# EAGLE design StaticPlatformMain_v1 (EAGLE 9.6.2)
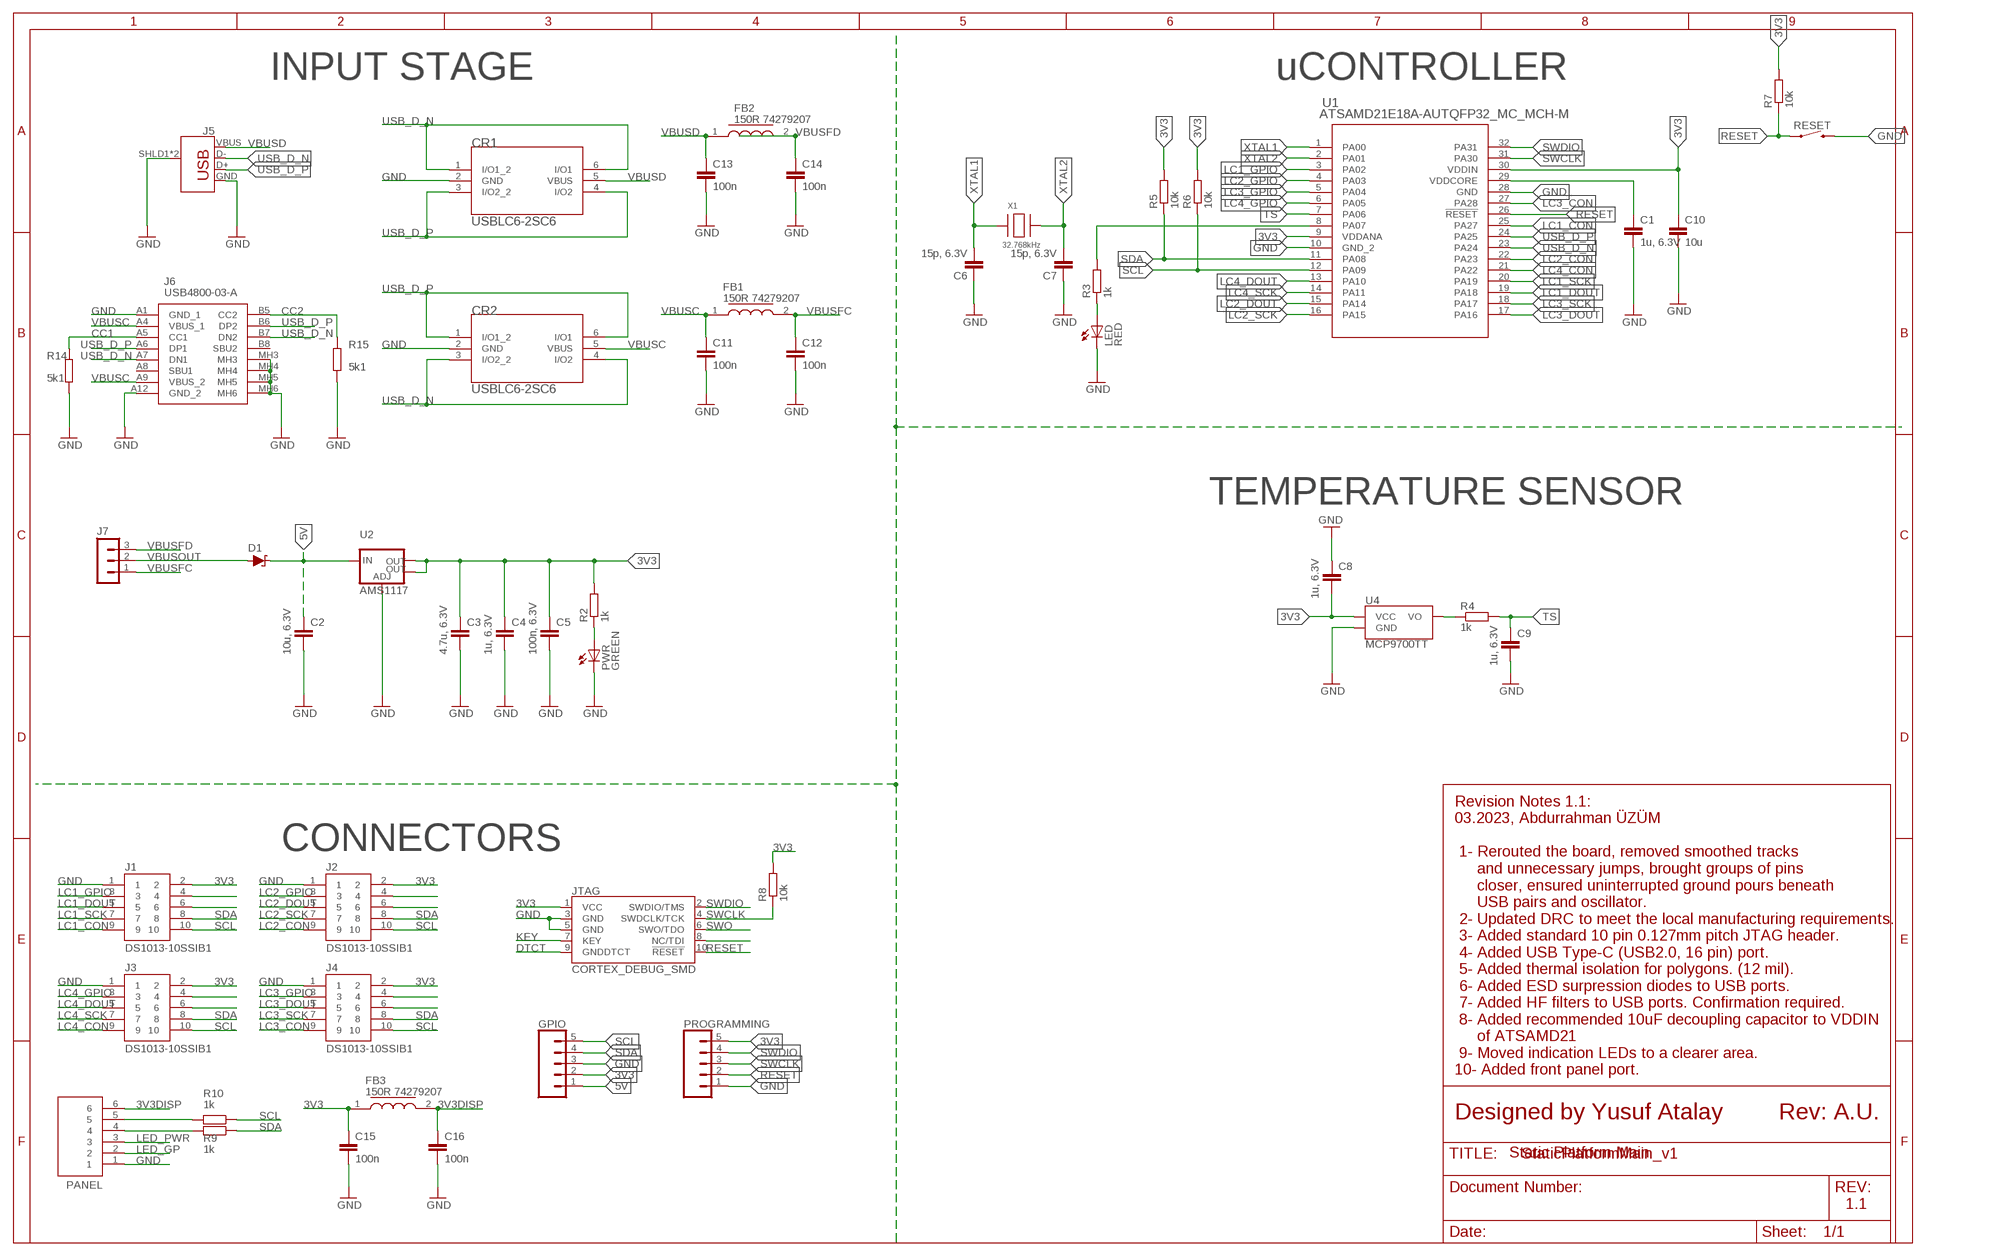
[diagram p0: schematic, sheet 1]

## Parts
C1  1u, 6.3V  C-EUC0805  [C0805]
C2  10u, 6.3V  C-EUC0805  [C0805]
C3  4.7u, 6.3V  C-EUC0805  [C0805]
C4  1u, 6.3V  C-EUC0805  [C0805]
C5  100n, 6.3V  C-EUC0805  [C0805]
C6  15p, 6.3V  C-EUC0805  [C0805]
C7  15p, 6.3V  C-EUC0805  [C0805]
C8  1u, 6.3V  C-EUC0805  [C0805]
C9  1u, 6.3V  C-EUC0805  [C0805]
C10  10u  C-EUC0805  [C0805]
C11  100n  C-EUC0805  [C0805]
C12  100n  C-EUC0805  [C0805]
C13  100n  C-EUC0805  [C0805]
C14  100n  C-EUC0805  [C0805]
C15  100n  C-EUC0805  [C0805]
C16  100n  C-EUC0805  [C0805]
CR1  USBLC6-2SC6  [SOT23-6L_STM]
CR2  USBLC6-2SC6  [SOT23-6L_STM]
D1  3A/10V/280mV  DIODE-SCHOTTKY-BAT60A  [SOD-323]
FB1  150R 74279207  74279207  [CAPC2012X90N]
FB2  150R 74279207  74279207  [CAPC2012X90N]
FB3  150R 74279207  74279207  [CAPC2012X90N]
GPIO  CONN_05NO_SILK  [1X05_NO_SILK]
J1  DS1013-10SSIB1  [CONNFLY_DS1013-10SSIB1]
J2  DS1013-10SSIB1  [CONNFLY_DS1013-10SSIB1]
J3  DS1013-10SSIB1  [CONNFLY_DS1013-10SSIB1]
J4  DS1013-10SSIB1  [CONNFLY_DS1013-10SSIB1]
J5  USB_B_PTH  [USB-B-PTH]
J6  USB4800-03-A  [USB480003A]
J7  MA03-1  [MA03-1]
JTAG  CORTEX_DEBUG_SMD  [SAMTECH_FTSH-105-01]
LED  RED  LEDCHIPLED_0805  [CHIPLED_0805]
PANEL  S3B-XH-A(LF)(SN)  [JST_S3B-XH-A(LF)(SN)]
PROGRAMMING  CONN_05NO_SILK  [1X05_NO_SILK]
PWR  GREEN  LEDCHIPLED_0805  [CHIPLED_0805]
R2  1k  R-EU_R0805  [R0805]
R3  1k  R-EU_R0805  [R0805]
R4  1k  R-EU_R0805  [R0805]
R5  10k  R-EU_R0805  [R0805]
R6  10k  R-EU_R0805  [R0805]
R7  10k  R-EU_R0805  [R0805]
R8  10k  R-EU_R0805  [R0805]
R9  1k  R-EU_R0805  [R0805]
R10  1k  R-EU_R0805  [R0805]
R14  5k1  R-EU_R0805  [R0805]
R15  5k1  R-EU_R0805  [R0805]
RESET  MOMENTARY-SWITCH-SPST-SMD-6.0X3.5MM  [TACTILE_SWITCH_SMD_6.0X3.5MM]
U1  ATSAMD21E18A-AUTQFP32_MC_MCH-M  [TQFP32_MC_MCH-M]
U2  AMS1117  V_REG_LM1117SOT223  [SOT223]
U4  MCP9700TT  [SOT23-3]
X1  32.768kHz  XTAL-3.2X1.5  [XTAL3215]

## Nets
3V1: R3.2 U1.8(PA07)
3V3: C3.1 C4.1 C5.1 C8.2 C10.1 C15.1 FB3.1 GPIO.2 J1.2 J2.2 J3.2 J4.2 JTAG.1(VCC) PROGRAMMING.5 R2.2 R5.2 R6.2 R7.2 R8.2 U1.9(VDDANA) U1.30(VDDIN) U2.2(OUT) U2.4(OUT) U4.1(VCC)
3V3DISP: C16.1 FB3.2 PANEL.6
5V: C2.1 D1.C GPIO.1 U2.3(IN)
CC1: J6.A5(CC1) R14.2
CC2: J6.B5(CC2) R15.2
DTCT: JTAG.9(GNDDTCT)
GND: C1.2 C2.2 C3.2 C4.2 C5.2 C6.1 C7.1 C8.1 C9.2 C10.2 C11.2 C12.2 C13.2 C14.2 C15.2 C16.2 CR1.2(GND) CR2.2(GND) GPIO.3 J1.1 J2.1 J3.1 J4.1 J5.GND J5.SHLD1(SHIELD) J5.SHLD2(SHIELD) J6.A1(GND_1) J6.A12(GND_2) J6.MH3 J6.MH4 J6.MH5 J6.MH6 JTAG.3(GND) JTAG.5(GND) LED.C PANEL.1 PROGRAMMING.1 PWR.C R14.1 R15.1 RESET.2 U1.10(GND_2) U1.28(GND) U2.1(ADJ) U4.3(GND)
KEY: JTAG.7(KEY)
LC1_CON: J1.9 U1.25(PA27)
LC1_DOUT: J1.5 U1.19(PA18)
LC1_GPIO: J1.3 U1.3(PA02)
LC1_SCK: J1.7 U1.20(PA19)
LC2_CON: J2.9 U1.22(PA23)
LC2_DOUT: J2.5 U1.15(PA14)
LC2_GPIO: J2.3 U1.4(PA03)
LC2_SCK: J2.7 U1.16(PA15)
LC3_CON: J4.9 U1.27(PA28)
LC3_DOUT: J4.5 U1.17(PA16)
LC3_GPIO: J4.3 U1.5(PA04)
LC3_SCK: J4.7 U1.18(PA17)
LC4_CON: J3.9 U1.21(PA22)
LC4_DOUT: J3.5 U1.13(PA10)
LC4_GPIO: J3.3 U1.6(PA05)
LC4_SCK: J3.7 U1.14(PA11)
LED_GP: LED.A PANEL.2 R3.1
LED_PWR: PANEL.3 PWR.A R2.1
N$1: PANEL.5 R10.2
N$2: PANEL.4 R9.2
N$6: C1.1 U1.29(VDDCORE)
N$8: R4.1 U4.2(VO)
N$13: J1.4
N$16: J1.6
N$24: JTAG.8(NC/TDI)
N$28: J2.4
N$29: J2.6
N$38: J4.4
N$39: J4.6
N$48: J3.4
N$49: J3.6
RESET: JTAG.10(!RESET) PROGRAMMING.2 R7.1 RESET.1 U1.26(!RESET)
SCL: GPIO.5 J1.10 J2.10 J3.10 J4.10 R6.1 R10.1 U1.12(PA09)
SDA: GPIO.4 J1.8 J2.8 J3.8 J4.8 R5.1 R9.1 U1.11(PA08)
SWCLK: JTAG.4(SWDCLK/TCK) PROGRAMMING.3 R8.1 U1.31(PA30)
SWDIO: JTAG.2(SWDIO/TMS) PROGRAMMING.4 U1.32(PA31)
SWO: JTAG.6(SWO/TDO)
TS: C9.1 R4.2 U1.7(PA06)
USB_D_N [usbpair]: CR1.1(I/O1_2) CR1.6(I/O1) CR2.3(I/O2_2) CR2.4(I/O2) J5.D- J6.A7(DN1) J6.B7(DN2) U1.23(PA24)
USB_D_P [usbpair]: CR1.3(I/O2_2) CR1.4(I/O2) CR2.1(I/O1_2) CR2.6(I/O1) J5.D+ J6.A6(DP1) J6.B6(DP2) U1.24(PA25)
VBUSC: C11.1 CR2.5(VBUS) FB1.1 J6.A4(VBUS_1) J6.A9(VBUS_2)
VBUSD: C13.1 CR1.5(VBUS) FB2.1 J5.VBUS
VBUSFC: C12.1 FB1.2 J7.1
VBUSFD: C14.1 FB2.2 J7.3
VBUSOUT: D1.A J7.2
XTAL1: C6.2 U1.1(PA00) X1.P$1
XTAL2: C7.2 U1.2(PA01) X1.P$2
Unconnected: J6.A8(SBU1) J6.B8(SBU2)

## Notes on the sheet
- INPUT STAGE | uCONTROLLER
- TEMPERATURE SENSOR
- CONNECTORS
- Revision Notes 1.1:
  03.2023, Abdurrahman ÜZÜM
  
   1- Rerouted the board, removed smoothed tracks
       and unnecessary jumps, brought groups of pins
       closer, ensured uninterrupted ground pours beneath
       USB pairs and oscillator.
   2- Updated DRC to meet the local manufacturing requirements.
   3- Added standard 10 pin 0.127mm pitch JTAG header.
   4- Added USB Type-C (USB2.0, 16 pin) port.
   5- Added thermal isolation for polygons. (12 mil).
   6- Added ESD surpression diodes to USB ports.
   7- Added HF filters to USB ports. Confirmation required.
   8- Added recommended 10uF decoupling capacitor to VDDIN
       of ATSAMD21
   9- Moved indication LEDs to a clearer area.
  10- Added front panel port.
- Designed by Yusuf Atalay | Rev: A.U.
- Static Platform Main
- 1.1

## Library data of the parts
C1-C16 = rcl:C-EU: CAPACITOR, European symbol; SPICEPREFIX: C
CR1 CR2 = usblc6:USBLC6-2SC6; COPYRIGHT: Copyright (C) 2023 Ultra Librarian. All rights reserved.; MANUFACTURER_PART_NUMBER: USBLC6-2SC6; MFR_NAME: STMicroelectronics
D1 = SparkFun-DiscreteSemi:DIODE-SCHOTTKY: Schottky diode A Schottky diode is a semiconductor diode which has a low forward voltage drop and a very fast switching action.; PROD_ID: DIO-14072
FB1-FB3 = FB_74279207:74279207: SMD EMI Suppression Ferrite Beads WE-CBF Source: Datasheet; DESCRIPTION: SMD EMI Suppression Ferrite Beads WE-CBF; HEIGHT: 0.9mm; MANUFACTURER_NAME: Wurth Elektronik; MANUFACTURER_PART_NUMBER: 74279207; MOUSER_PART_NUMBER: 710-74279207; MOUSER_PRICE-STOCK: https://www.mouser.co.uk/ProductDetail/Wurth-Elektronik/74279207?qs=Wn16VcyqZWrAx3dDPZmCbQ%3D%3D
GPIO PROGRAMMING = SparkFun-Connectors:CONN_05: Multi connection point. Often used as Generic Header-pin footprint for 0.1 inch spaced/style header connections On any of the 0.1 inch spaced packages, you can populate with these: Break Away Headers - Straight <https://www.sparkfun.com/products/116> (PRT-00116) Break Away Male Headers - Right Angle <https://www.sparkfun.com/products/553> (PRT-00553) Female Headers <https://www.sparkfun.com/products/115> (PRT-00115) Break Away Headers - Machine Pin <https://www.sparkfun.com/products/117> (PRT-00117) Break Away Female Headers - Swiss Machine Pin <https://www.sparkfun.com/products/743> (PRT-00743) For SCREWTERMINALS and SPRING TERMINALS visit here: Screw Terimnals on SparkFun.com <https://www.sparkfun.com/search/results?term=Screw+Terminals> (5mm/3.5mm/2.54mm spacing) This device is also useful as a general connection point to wire up your design to another part of your project. Our various solder wires solder well into these plated through hole pads. Hook-Up Wire - Assortment (Stranded, 22 AWG) <https://www.sparkfun.com/products/11375> (PRT-11375) Hook-Up Wire - Assortment (Solid Core, 22 AWG) <https://www.sparkfun.com/products/11367> (PRT-11367) View the entire wire category on our website here <https://www.sparkfun.com/categories/141> Special notes: Molex polarized connector foot print use with SKU : PRT-08231 with associated crimp pins and housings. 1MM SMD Version SKU: PRT-10208
J1-J4 = IDC_CON_DS1013-10SSIB1:DS1013-10SSIB1: Socket; IDC; male; PIN: 10; straight; THT; gold-plated; 2.54mm Check availability <https://pricing.snapeda.com/parts/DS1013-10SSIB1/Connfly/view-part?ref=eda>; AVAILABILITY: Not in stock; DESCRIPTION: Socket; IDC; male; PIN: 10; straight; THT; gold plated; 2.54mm; MF: Connfly; MP: DS1013-10SSIB1; PACKAGE: None; PRICE: None
J5 = SparkFun-Connectors:USB_B: USB Type B Connector SparkFun Products: SparkFun Stepoko <https://www.sparkfun.com/products/13899> PTH; PROD_ID: CONN-08278; SF_ID: PRT-00139
J6 = USB4800-03-A:USB4800-03-A: USB Connectors USB2.0 Type C Rcpt, SMT, Hrz, 3.5mm elevated, 16 Pin Source: Datasheet <https://gct.co/connector/usb4800>; DESCRIPTION: USB Connectors USB2.0 Type C Rcpt, SMT, Hrz, 3.5mm elevated, 16 Pin; HEIGHT: 5.58mm; MANUFACTURER_NAME: GCT (GLOBAL CONNECTOR TECHNOLOGY); MANUFACTURER_PART_NUMBER: USB4800-03-A; MOUSER_PART_NUMBER: 640-USB4800-03-A; MOUSER_PRICE-STOCK: https://www.mouser.co.uk/ProductDetail/GCT/USB4800-03-A?qs=vvQtp7zwQdMkfG8vViEZoQ%3D%3D
J7 = con-lstb_round_pads:MA03-1: PIN HEADER; OC_FARNELL: unknown; OC_NEWARK: unknown
JTAG = SparkFun-Connectors:CORTEX_DEBUG: Cortex Debug Connector - 10 pin Supports JTAG debug, Serial Wire debug, and Serial Wire Viewer. PTH and SMD connector options available. General Connector Information <http://infocenter.arm.com/help/topic/com.arm.doc.faqs/attached/13634/cortex_debug_connectors.pdf> Products: PTH Connector <http://www.digikey.com/product-detail/en/cnc-tech/3220-10-0100-00/1175-1627-ND/3883661> -via Digi-Key SparkFun PSoc <https://www.sparkfun.com/products/13229> SparkFun T <https://www.sparkfun.com/products/13810>
LED PWR = adafruit:LED: LED OSRAM: - CHIPLED LG R971, LG N971, LY N971, LG Q971, LY Q971, LO R971, LY R971 LH N974, LH R974 LS Q976, LO Q976, LY Q976 LO Q996 - Hyper CHIPLED LW Q18S LB Q993, LB Q99A, LB R99A - SideLED LS A670, LO A670, LY A670, LG A670, LP A670 LB A673, LV A673, LT A673, LW A673 LH A674 LY A675 LS A676, LA A676, LO A676, LY A676, LW A676 LS A679, LY A679, LG A679 - Hyper Micro SIDELED® LS Y876, LA Y876, LO Y876, LY Y876 LT Y87S - SmartLED LW L88C, LW L88S LB L89C, LB L89S, LG L890 LS L89K, LO L89K, LY L89K LS L896, LA L896, LO L896, LY L896 - TOPLED LS T670, LO T670, LY T670, LG T670, LP T670 LSG T670, LSP T670, LSY T670, LOP T670, LYG T670 LG T671, LOG T671, LSG T671 LB T673, LV T673, LT T673, LW T673 LH T674 LS T676, LA T676, LO T676, LY T676, LB T676, LH T676, LSB T676, LW T676 LB T67C, LV T67C, LT T67C, LS T67K, LO T67K, LY T67K, LW E67C LS E67B, LA E67B, LO E67B, LY E67B, LB E67C, LV E67C, LT E67C LW T67C LS T679, LY T679, LG T679 LS T770, LO T770, LY T770, LG T770, LP T770 LB T773, LV T773, LT T773, LW T773 LH T774 LS E675, LA E675, LY E675, LS T675 LS T776, LA T776, LO T776, LY T776, LB T776 LHGB T686 LT T68C, LB T68C - Hyper Mini TOPLED® LB M676 - Mini TOPLED Santana® LG M470 LS M47K, LO M47K, LY M47K Source: http://www.osram.convergy.de/
PANEL = S6B-XH-A_LF__SN_:S3B-XH-A(LF)(SN): Connector Header Through Hole, Right Angle 3 position 0.098" (2.50mm) Check availability <https://pricing.snapeda.com/parts/S3B-XH-A%28LF%29%28SN%29/JST%20Sales/view-part?ref=eda>; AVAILABILITY: In Stock; DESCRIPTION: Connector Header Through Hole, Right Angle 3 position 0.098 (2.50mm); MF: JST Sales; MP: S3B-XH-A(LF)(SN); PACKAGE: Custom Package JST Sales; PRICE: None; PURCHASE-URL: https://pricing.snapeda.com/search/part/S3B-XH-A(LF)(SN)/?ref=eda
R2-R10 R14 R15 = rcl:R-EU_: RESISTOR, European symbol; SPICEPREFIX: R
RESET = SparkFun-Switches:MOMENTARY-SWITCH-SPST: Momentary Switch (Pushbutton) - SPST Normally-open (NO) SPST momentary switches (buttons, pushbuttons). Variants PTH-12MM - 12mm square, through-hole Momentary Pushbutton Switch - 12mm Square <https://www.sparkfun.com/products/9190> (COM-09190) PTH-6.0MM, PTH-6.0MM-KIT - 6.0mm square, through-hole Mini Pushbutton Switch <https://www.sparkfun.com/products/97> (COM-00097) KIT package intended for soldering kit's - only one side of pads' copper is exposed. PTH-RIGHT-ANGLE-KIT - Right-angle, through-hole Right Angle Tactile Button <https://www.sparkfun.com/products/10791> - Used on SparkFun BigTime Watch Kit <https://www.sparkfun.com/products/11734> SMD-12MM - 12mm square, surface-mount Tactile Button - SMD (12mm) <https://www.sparkfun.com/products/12993> (COM-12993) Used on SparkFun PicoBoard <https://www.sparkfun.com/products/11888> SMD-4.5MM - 4.5mm Square Trackball Switch Used on SparkFun Blackberry Trackballer Breakout <https://www.sparkfun.com/products/13169> SMD-4.6MMX2.8MM - 4.60mm x 2.80mm, surface mount Used on SparkFun Pro Micro - RP2040 <https://www.sparkfun.com/products/17717> SMD-5.2MM, SMD-5.2-REDUNDANT - 5.2mm square, surface-mount Mini Pushbutton Switch - SMD <https://www.sparkfun.com/products/8720> (COM-08720) Used on Arduino Pro Mini <https://www.sparkfun.com/products/11114> REDUNDANT package connects both switch circuits together SMD-6.0X3.5MM - 6.0 x 3.5mm, surface mount Momentary Reset Switch SMD <https://www.sparkfun.com/products/8229> (COM-08229) SMD-6.2MM-TALL - 6.2mm square, surface mount Tactile Button - SMD (6mm) <https://www.sparkfun.com/products/12992> Used on SparkFun Digital Sandbox <https://www.sparkfun.com/products/12651> SMD-RIGHT-ANGLE - Right-angle, surface mount Used on SparkFun Block for Intel® Edison - Arduino <https://www.sparkfun.com/products/13036>; PROD_ID: SWCH-14278; SF_SKU: COM-08229
U1 = SAMD21E18:ATSAMD21E18A-AU; COPYRIGHT: Copyright (C) 2022 Ultra Librarian. All rights reserved.; MANUFACTURER_PART_NUMBER: ATSAMD21E18A-AU; MFR_NAME: Microchip
U2 = SparkFun-IC-Power:V_REG_LM1117: Voltage Regulator LM1117 Standard adjustable voltage regulator but in SMD form. Spark Fun Electronics SKU : COM-00595; PROD_ID: VREG-08170
U4 = SparkFun-Sensors:MCP9700: Microchip MCP9700 Analog-Output Temperature Sensor The MCP9700 can accurately measure temperature from -40C to +150C. The output of the MCP9700 is calibrated to a slope of 10mV/°C and has a DC offset of 500mV. The offset allows reading negative temperatures without the need for a negative supply. Datasheet <http://ww1.microchip.com/downloads/en/DeviceDoc/20001942F.pdf> SparkFun Products LilyPad Temperature Sensor <https://www.sparkfun.com/products/8777> (DEV-08777) SparkFun Digital Sandbox <https://www.sparkfun.com/products/12651> (DEV-12651); PROD_ID: IC-08917
X1 = adafruit:XTAL: Low cost SMT crystals, no capacitors included http://www.ladyada.net/library/eagle

## Net classes
1 usbpair: width 0.25 mm, clearance 0.2 mm

## Board
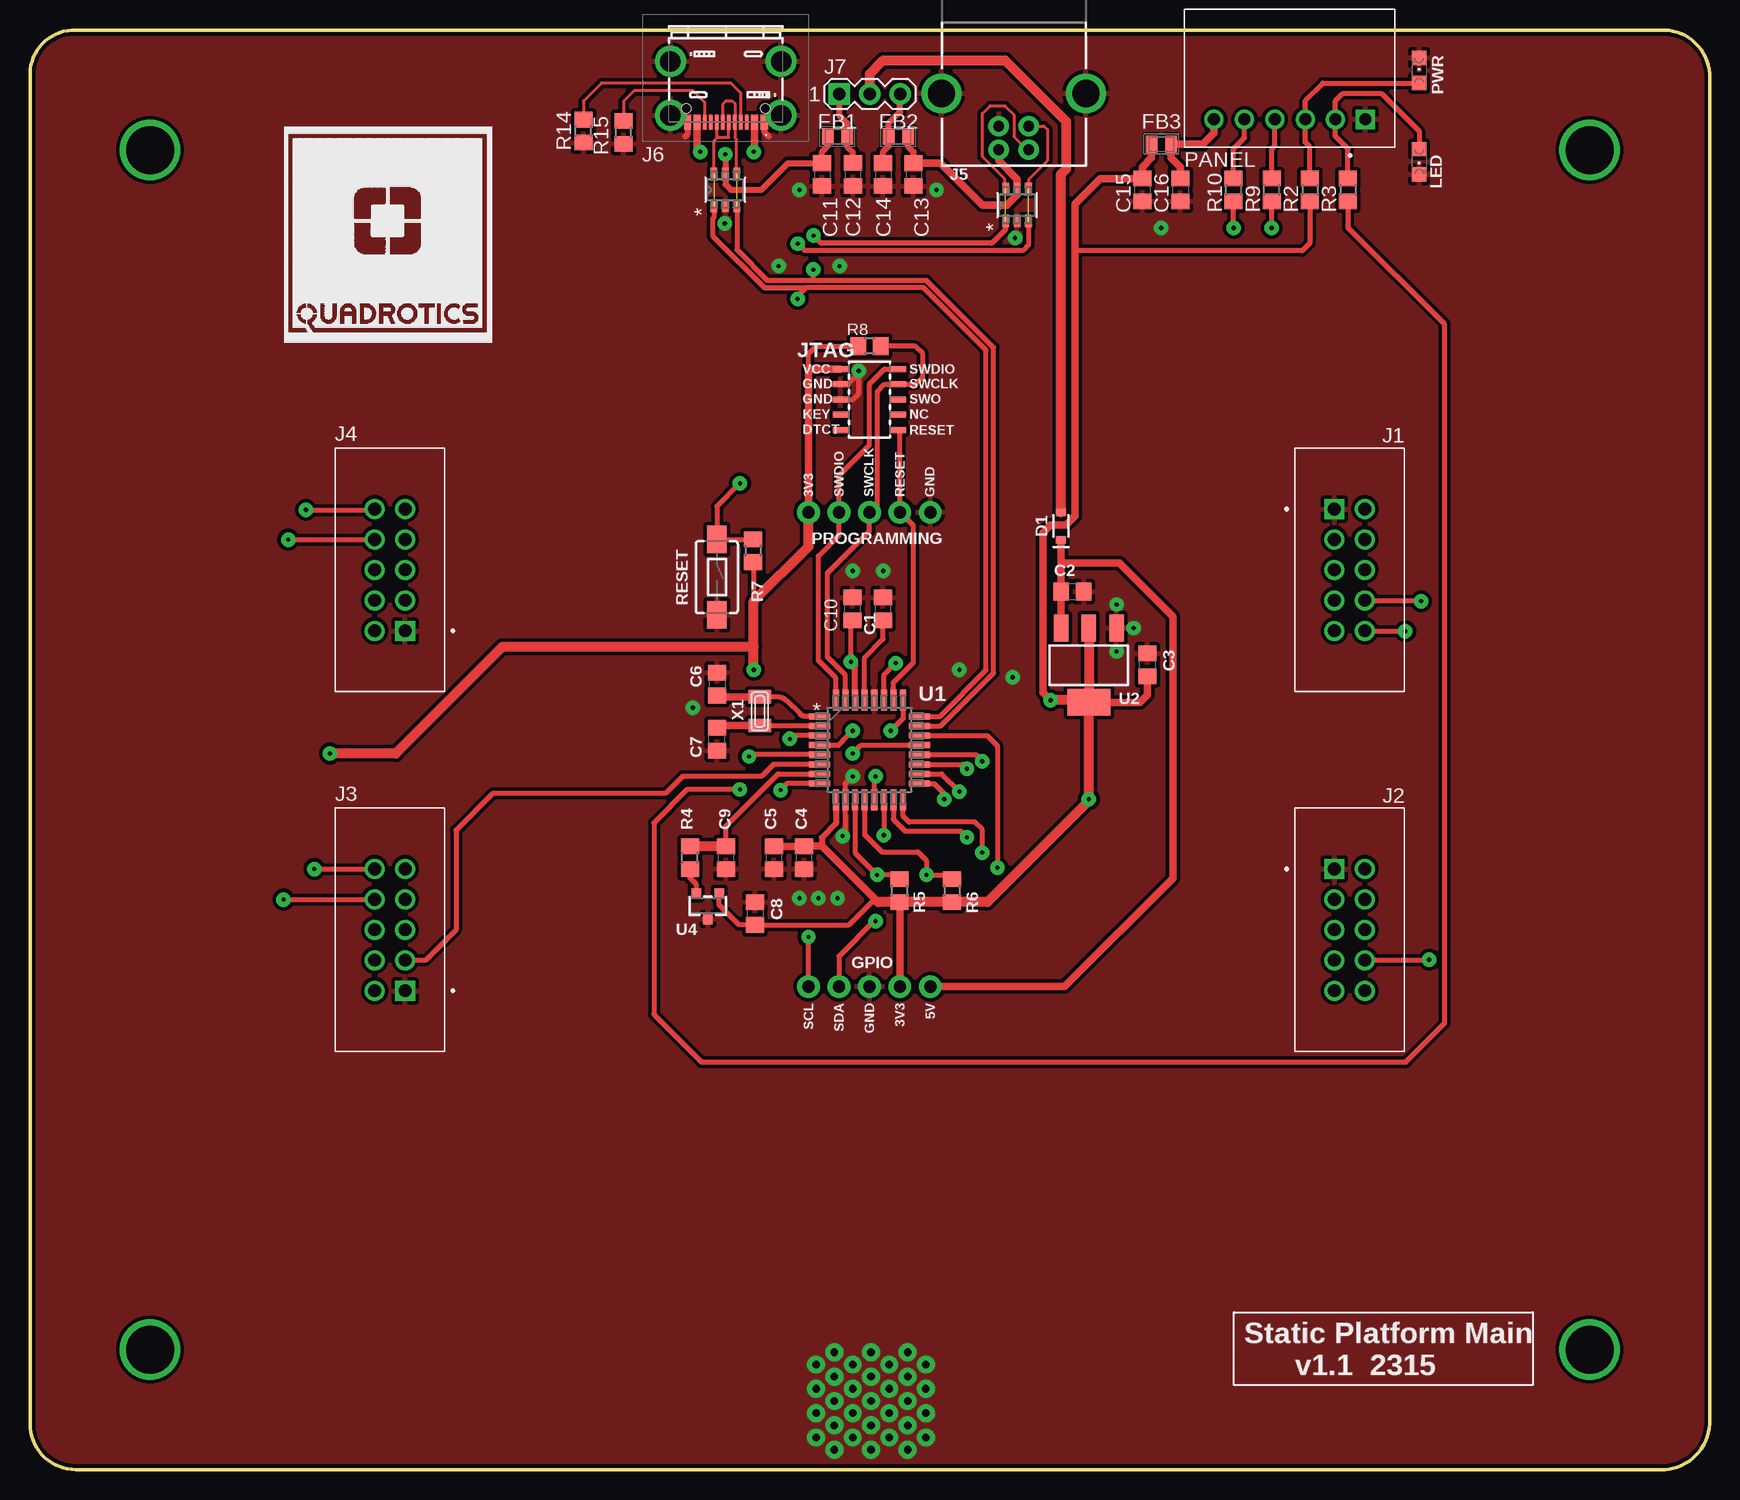
[diagram p1: board, top side]
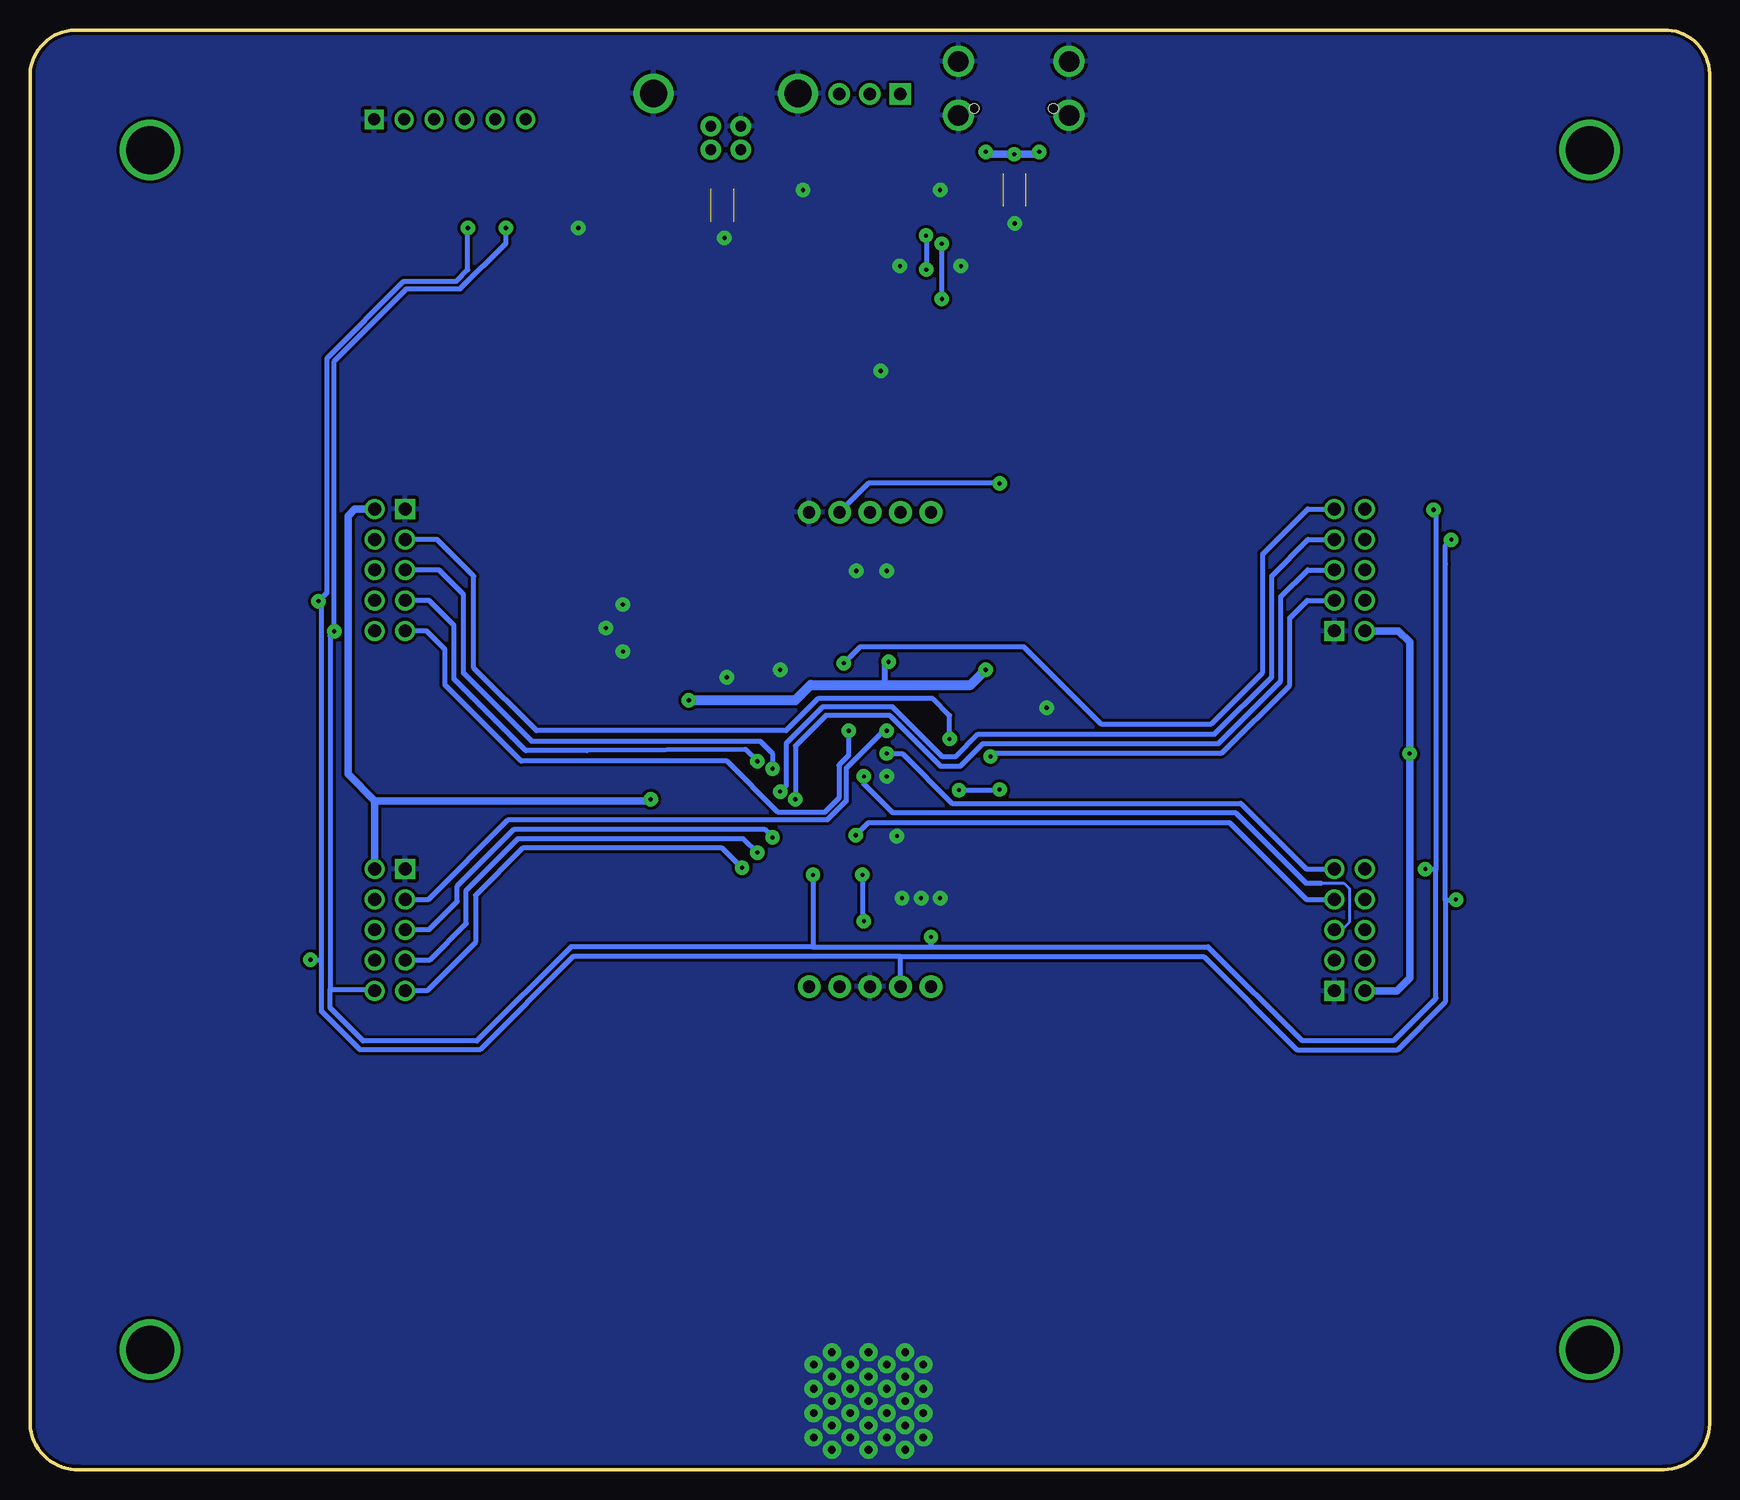
[diagram p2: board, bottom side, seen from below]

Size 140 x 120.01 mm. Coordinates in mm from the lower left corner, seen from the top.
Outline: 3.81,120 135.89,120 arc-90 140,116.38 140,3.81 arc-90 135.89,0 3.81,0 arc-90 0,3.81 0,116.38 arc-90 3.81,120
Copper layers (1*16): Top 0.035mm / dielectric 1.5mm / Bottom 0.035mm
Design rules "default *": minimum track width 0.25mm, minimum drill 0.35mm, track to track 0.2mm, track to pad 0.2mm, pad to pad 0.2mm, via to via 0.2mm, smd to smd 0.2mm, copper to edge 0.2mm, drill to drill 0.2mm, minimum pad ring 0.3mm, minimum via ring 0.425mm, stop-mask expansion 4mil, vias tented up to drill 0mil, thermal gap 12mil

### Footprints (pad centres in the part's own frame; a part is rotated, then mirrored left to right if it is on the bottom)
C0805 = smd 1.3 x 1.5: 1 -0.95,0; 2 0.95,0
SOT23-6L_STM = smd 0.978 x 0.559: 1 -1.365,0.95; 2 -1.365,0; 3 -1.365,-0.95; 4 1.365,-0.95; 5 1.365,0; 6 1.365,0.95
SOD-323 = smd 0.63 x 0.83: A 1.15,0; C -1.15,0
CAPC2012X90N = smd 0.96 x 1.39: 1 -0.81,0; 2 0.81,0
1X05_NO_SILK = drill 1.016 pad 1.88: 1 0,0; 2 2.54,0; 3 5.08,0; 4 7.62,0; 5 10.16,0
CONNFLY_DS1013-10SSIB1 = drill 1.07 square: 1 -5.08,-1.27 | drill 1.07: 2 -5.08,1.27; 3 -2.54,-1.27; 4 -2.54,1.27; 5 0,-1.27; 6 0,1.27; 7 2.54,-1.27; 8 2.54,1.27; 9 5.08,-1.27; 10 5.08,1.27
USB-B-PTH = drill 0.914 pad 1.676: D+ 4,1.25; D- 5.981,1.25; GND 4,-1.25; VBUS 5.981,-1.25 | drill 2.286: SHLD1 1.282,-6.02; SHLD2 1.282,6.02
USB480003A = smd 0.6 x 1.25: A1 -3.2,3.675; A4 -2.4,3.675; A9 2.4,3.675; A12 3.2,3.675 | smd 0.3 x 1.25: A5 -1.25,3.675; A6 -0.25,3.675; A7 0.25,3.675; A8 1.25,3.675; B5 1.75,3.675; B6 0.75,3.675; B7 -0.75,3.675; B8 -1.75,3.675 | drill 1.71 pad 2: MH3 -4.61,3.1; MH4 4.61,3.1 | drill 1.71 pad 2.565: MH5 -4.61,-1.4; MH6 4.61,-1.4 | hole 0.8: -3.3,2.54; 3.3,2.54
MA03-1 = drill 1.016 pad 1.778 square: 1 -2.54,0 | drill 1.016 pad 1.778: 2 0,0; 3 2.54,0
SAMTECH_FTSH-105-01 = smd 0.508 x 1.27: 1 -2.54,-2.413; 2 -2.54,2.413; 3 -1.27,-2.413; 4 -1.27,2.413; 5 0,-2.413; 6 0,2.413; 7 1.27,-2.413; 8 1.27,2.413; 9 2.54,-2.413; 10 2.54,2.413
CHIPLED_0805 = smd 1.2 x 1.2: A 0,-1.05; C 0,1.05
JST_S3B-XH-A(LF)(SN) = drill 1 square: 1 6.31,-3.45 | drill 1: 2 3.81,-3.45; 3 1.31,-3.45; 4 -1.23,-3.45; 5 -3.77,-3.45; 6 -6.31,-3.45
R0805 = smd 1.3 x 1.5: 1 -0.95,0; 2 0.95,0
TACTILE_SWITCH_SMD_6.0X3.5MM = smd 2.3 x 1.6: 1 -3.15,0; 2 3.15,0
TQFP32_MC_MCH-M = smd 1.762 x 0.507: 1 -4.169,2.8; 2 -4.169,2; 3 -4.169,1.2; 4 -4.169,0.4; 5 -4.169,-0.4; 6 -4.169,-1.2; 7 -4.169,-2; 8 -4.169,-2.8; 17 4.169,-2.8; 18 4.169,-2; 19 4.169,-1.2; 20 4.169,-0.4; 21 4.169,0.4; 22 4.169,1.2; 23 4.169,2; 24 4.169,2.8 | smd 0.507 x 1.762: 9 -2.8,-4.169; 10 -2,-4.169; 11 -1.2,-4.169; 12 -0.4,-4.169; 13 0.4,-4.169; 14 1.2,-4.169; 15 2,-4.169; 16 2.8,-4.169; 25 2.8,4.169; 26 2,4.169; 27 1.2,4.169; 28 0.4,4.169; 29 -0.4,4.169; 30 -1.2,4.169; 31 -2,4.169; 32 -2.8,4.169
SOT223 = smd 1.219 x 2.235: 1 -2.311,-3.099; 2 0,-3.099; 3 2.311,-3.099 | smd 3.6 x 2.2: 4 0,3.099
SOT23-3 = smd 0.8 x 0.9: 1 -0.95,-1; 2 0.95,-1; 3 0,1.1
XTAL3215 = smd 1.1 x 1.9: P$1 1.2,0; P$2 -1.2,0

### Placement (x,y rotation side)
C1  71.12,71.75 90 top
C2  86.89,73.2 0 top
C3  93.14,67.09 90 top
C4  64.5,51 270 top
C5  62,51 270 top
C6  57.28,65.48 270 top
C7  57.28,60.88 90 top
C8  60.45,46.35 270 top
C9  58,51 270 top
C10  68.58,71.75 90 top
C11  66.04,107.95 270 top
C12  68.58,107.97 270 top
C13  73.66,107.95 270 top
C14  71.12,107.95 270 top
C15  92.71,106.68 270 top
C16  95.89,106.68 270 top
CR1  82.28,105.41 90 top
CR2  57.96,106.68 90 top
D1  85.93,78.66 90 top
FB1  67.31,111.12 0 top
FB2  72.39,111.12 180 top
FB3  94.3,110.49 0 top
GPIO  75.06,40.26 180 top
J1  110,75 270 top
J2  110,45 270 top
J3  30,45 90 top
J4  30,75 90 top
J5  82,116 270 top
J6  58,116 180 top
J7  70,114.68 0 top
JTAG  69.98,89.2 270 top
LED  115.8,109.02 180 top
PANEL  105,116 0 top
PROGRAMMING  75.06,79.8 180 top
PWR  115.8,116.64 0 top
R2  106.68,106.68 270 top
R3  109.86,106.68 270 top
R4  55,51 90 top
R5  72.47,48.26 270 top
R6  76.85,48.26 270 top
R7  60.27,76.6 270 top
R8  69.98,93.65 180 top
R9  103.5,106.68 90 top
R10  100.33,106.68 90 top
R14  46.13,111.58 90 top
R15  49.49,111.46 90 top
RESET  57.25,74.39 270 top
U1  69.98,59.99 0 top
U2  88.27,67.05 180 top
U4  56.5,47.01 180 top
X1  60.83,63.22 90 top

### Tracks (layer width: path | path; a pad name or v marks a point on that pad's centre or on a via)
3V1  (via drill 0.35)
  Top 0.406: U1.8 63.11,57.19 v62.56,56.64 | v59.18,56.69 54.79,56.69 52,53.91 52,37.96 55.98,33.98 114.69,33.98 117.92,37.22 117.92,95.47 109.87,103.52 109.87,105.72 R3.2
  Bottom 0.406: v62.56,56.64 59.23,56.64 v59.18,56.69
3V3  (via drill 0.35)
  Top 0.406: 64.9,91.74 64.9,93.01 65.53,93.65 R8.2 | U4.1 57.45,47.05 59.09,45.41 C8.2 68.27,45.41 70.43,47.57 | R7.2 60.33,75.6 60.33,72.39 | v68.43,67.34 68.43,70.66 C10.1 | R2.2 106.68,102.23 106.05,101.6 87.09,101.6
  Top 0.508: U1.30 68.78,66.99 v68.43,67.34 | U1.9 67.18,53.84 66,52.66 66,52
  Top 0.61: GPIO.2 72.52,47.19 arc45 R5.2 | JTAG.1 64.9,91.74 PROGRAMMING.5 | 70.69,47.31 70.43,47.57 66,52 64.55,52 C4.1 C5.1 | U2.4 92.53,63.95 93.14,64.57 C3.1 | v85.09,64.14 84.45,64.77 84.45,78.12 85.08,78.74 86.36,78.74 87.09,79.47 87.09,101.6 87.09,105.5 89.22,107.63 C15.1 92.71,108.58 93.49,109.36 FB3.1
  Top 0.813: U2.2 U2.4 | U2.4 88.08,64.14 v85.09,64.14 | v60.33,66.67 60.33,68.58 | v25,59.69 30.48,59.69 39.37,68.58 60.33,68.58 | 60.33,68.58 60.33,72.39 64.9,76.96 PROGRAMMING.5 | 70.69,47.31 R5.2 R6.2 79.81,47.31 88.27,55.77 v88.27,55.88 U2.4
  Bottom 0.508: v68.43,67.34 68.76,67.01 68.76,65.41
  Bottom 0.61: J1.2 112.92,80.08 113.5,79.5 113.5,57.97 111.25,55.72 | J2.2 111.25,50.1 111.25,55.72 | J3.2 26.08,39.92 25,41 v25,59.69 25,69 25.92,69.92 J4.2 | v88.27,55.88 88.43,55.72 111.25,55.72
  Bottom 0.813: v85.09,64.14 76.2,64.14 74.93,65.41 68.76,65.41 61.59,65.41 v60.33,66.67
3V3DISP
  Top 0.61: C16.1 95.89,108.58 95.11,109.36 FB3.2 97.79,110.49 98.69,111.39 PANEL.6
5V
  Top 0.61: U2.3 85.95,73.17 arc45 C2.1 85.94,75.56 | 85.94,75.56 85.94,77.47 arc45 D1.C | GPIO.1 86.23,40.26 95.25,49.27 95.25,71.12 90.81,75.56 85.94,75.56
CC1
  Top 0.254: J6.A5 59.25,114.74 58.42,115.57 47.62,115.57 46.13,114.08 R14.2
CC2
  Top 0.254: J6.B5 56.25,113.95 55.27,114.94 50.34,114.94 49.49,114.08 R15.2
GND  (via drill 0.35, 0.64)
  Top 0.406: 90.6,70.13 U2.1 | 91.97,70.13 v92,70.15 | JTAG.3 68.2,90.47 69.09,91.36 v69.09,91.59 69.09,89.71 68.58,89.2 JTAG.5 | v67.74,52.81 67.98,53.05 U1.10 67.98,57.18 v68.58,57.78 | U4.3
  Top 0.508: 61.59,111.12 61.2,111.52 J6.A1 | J6.A12 54.8,111.31 54.61,111.12
  other vias: 90.58,72.11 90.57,68.2 65.53,2.67 65.53,4.7 67.06,3.68 68.58,2.67 68.58,4.7 70.1,3.68 71.63,4.7 71.63,2.67 73.15,3.68 74.68,2.67 74.68,4.7 74.68,6.73 74.68,8.76 73.15,5.71 73.15,7.75 71.63,6.73 70.1,5.71 67.06,5.71 65.53,6.73 65.53,8.76 67.06,7.75 68.58,6.73 70.1,7.75 68.58,8.76 67.06,9.78 70.1,9.78 71.63,8.76 73.15,9.78 67.06,1.65 70.1,1.65 73.15,1.65 68.58,74.93 71.12,74.93 64.14,47.62 65.72,47.62 67.31,47.62 77.47,66.67 81.92,66.04 62.41,100.33 67.48,100.33 82.11,102.67 57.92,103.89 64.14,106.68 75.56,106.68 94.3,103.5 55.24,63.5
  pour Top (isolate 0.305): -3.17,126.36 142.88,126.36 142.88,-3.17 -3.17,-3.17
  pour Bottom (isolate 0.254): -2.54,125.73 142.24,125.73 142.24,-2.54 -2.54,-2.54
LC1_CON  (via drill 0.35)
  Top 0.406: U1.25 72.78,62.62 v71.75,61.59
  Bottom 0.406: v71.75,61.59 71.75,59.54 72.57,58.73 72.57,55.98 73.77,54.78 77.64,54.78 81.92,59.05 99.06,59.05 105.41,65.41 105.41,68.38 106.95,69.92 J1.9
LC1_DOUT  (via drill 0.35)
  Top 0.406: U1.19 77.73,58.79 v78.11,58.42
  Bottom 0.406: J1.5 105.91,75 103.86,72.96 103.86,66.4 98.19,60.73 79.14,60.73 78.11,59.69 v78.11,58.42
LC1_GPIO  (via drill 0.35)
  Top 0.406: U1.3 63.63,61.19 v63.35,60.91
  Bottom 0.406: v63.35,60.91 63.35,62.87 64.75,64.26 74.3,64.26 76.96,61.59 97.79,61.59 103.02,66.82 103.02,74.48 106.08,77.54 J1.3
LC1_SCK  (via drill 0.35)
  Top 0.406: U1.20 78.84,59.59 v79.38,59.05
  Bottom 0.406: v79.38,59.05 80.36,60.04 93.58,59.94 98.68,59.94 104.65,65.91 104.65,70.38 106.73,72.46 J1.7
LC2_CON  (via drill 0.35)
  Top 0.406: U1.22 79.78,61.19 80.64,60.33 v80.64,50.16
  Bottom 0.406: J2.9 106.91,39.92 102.87,43.95 102.87,47.88 98.93,51.82 82.3,51.82 v80.64,50.16
LC2_DOUT  (via drill 0.35)
  Top 0.406: U1.15 71.98,54.21 72.97,53.21 77.6,53.21 v78.11,52.7
  Bottom 0.406: J2.5 106.77,45 104.39,47.37 104.39,48.64 99.64,53.39 78.79,53.39 v78.11,52.7
LC2_GPIO  (via drill 0.35)
  Top 0.406: U1.4 67.43,60.39 v68.58,61.59
  Bottom 0.406: J2.3 106.77,47.54 100.13,54.17 73.52,54.17 71.96,55.73 71.96,58.46 68.83,61.59 v68.58,61.59
LC2_SCK  (via drill 0.35)
  Top 0.406: v79.38,51.44 79.38,53.34 78.74,53.98 73.28,53.98 72.78,54.48 U1.16
  Bottom 0.406: J2.7 106.69,42.46 103.63,45.52 103.63,48.29 99.31,52.6 80.55,52.6 v79.38,51.44
LC3_CON  (via drill 0.35)
  Top 0.406: U1.27 71.18,66.25 v72.16,67.23
  Bottom 0.406: J4.9 33.48,80.08 37.23,76.33 37.23,66.45 41.53,62.15 50.72,62.15 57.17,68.61 70.79,68.61 v72.16,67.23
LC3_DOUT  (via drill 0.35)
  Top 0.406: U1.17 75.37,57.19 76.2,56.37 v76.2,55.88
  Bottom 0.406: J4.5 33.5,75 35.74,72.76 35.74,65.75 40.96,60.52 60.57,60.52 62.45,58.65 64.11,58.65 68.33,62.87 73.66,62.87 76.2,60.33 v76.2,55.88
LC3_GPIO  (via drill 0.35)
  Top 0.406: U1.5 60.29,59.59 arc45 v59.94,59.45
  Bottom 0.406: J4.3 33.54,72.46 35,71 35,65.38 40.64,59.74 59.78,59.74 59.94,59.58 v59.94,59.45
LC3_SCK  (via drill 0.35)
  Top 0.406: U1.18 75.99,57.99 v77.47,56.52
  Bottom 0.406: J4.7 33.46,77.54 36.5,74.5 36.5,66.05 41.25,61.3 60.97,61.3 62.8,59.46 63.98,59.46 68.1,63.57 73.92,63.57 76.96,60.53 76.96,57.03 v77.47,56.52
LC4_CON  (via drill 0.35)
  Top 0.406: U1.21 69.28,60.39 v68.58,59.69
  Bottom 0.406: J3.9 33.61,50.08 39.08,55.55 63.14,55.55 67.28,59.69 v68.58,59.69
LC4_DOUT  (via drill 0.35)
  Top 0.406: U1.13 70.38,57.68 v70.48,57.78
  Bottom 0.254: 32.38,48.9 30.48,48.9 30.02,48.44 30.02,45.61 30.64,45 J3.5
  Bottom 0.406: 32.38,48.9 33.66,48.9 39.5,54.74 68.07,54.74 70.48,57.15 v70.48,57.78
LC4_GPIO
  Top 0.406: J3.3 32.96,42.46 35.5,45 35.5,53.28 38.58,56.36 52.98,56.36 54.4,57.78 60.96,57.78 61.97,58.79 U1.6
LC4_SCK  (via drill 0.35)
  Top 0.406: U1.14 71.18,52.9 arc-45 v71.17,52.88
  Bottom 0.406: J3.7 33.61,47.54 40.01,53.94 70.11,53.94 v71.17,52.88
LED_GP
  Top 0.406: LED.A 115.8,111.56 112.63,114.73 109.45,114.73 108.82,114.1 PANEL.2 108.81,111.15 109.86,110.11 R3.1
LED_PWR
  Top 0.406: PANEL.3 | PANEL.3 106.32,114.14 107.77,115.59 PWR.A | PANEL.3 106.31,110.64 106.68,110.28 R2.1
N$1
  Top 0.406: R10.2 100.33,110.13 101.23,111.03 PANEL.5
N$2
  Top 0.406: R9.2 103.5,110.13 103.77,110.39 PANEL.4
N$6
  Top 0.406: U1.29 69.58,67.67 71.12,69.22 C1.1
N$8
  Top 0.406: U4.2 55.55,48.77 55,49.32 R4.1
N$14  (via drill 4)
  other vias: 130,110
N$15  (via drill 4)
  other vias: 10,110
N$17  (via drill 4)
  other vias: 10,10
N$18  (via drill 4)
  other vias: 130,10
RESET  (via drill 0.35)
  Top 0.406: JTAG.10 72.52,86.53 PROGRAMMING.2 73.63,78.69 73.63,67.28 71.98,65.63 U1.26 | v59.18,82.22 57.25,80.29 RESET.1 R7.1
  Bottom 0.406: v59.18,82.22 70.1,82.22 PROGRAMMING.2
SCL  (via drill 0.35)
  Top 0.406: J4.10 28.65,80 v23,80 | J3.10 28.71,50.06 v23.7,50.06 | U1.12 69.58,52.92 71,51.5 74,51.5 74.73,50.77 v74.73,49.58 76.48,49.58 R6.1 | J1.10 114.6,69.92 v114.64,69.88 | GPIO.5 v64.9,44.4 | v100.33,103.5 R10.1
  Bottom 0.406: v74.73,49.58 74.73,43.66 74.8,43.58 | 74.8,43.58 94.92,43.58 102.77,35.73 112.23,35.73 115,38.5 115,40 | 74.8,43.58 64.77,43.58 | 64.77,43.58 41.79,43.58 33.99,35.78 26.3,35.78 22.8,39.28 22.8,50.06 | v23.7,50.06 22.8,50.06 | v23,80 22.8,79.8 22.8,50.06 | 115,40 115,69.52 v114.64,69.88 114.64,92.4 108.62,98.42 104.14,98.42 100.33,102.23 v100.33,103.5 | J2.10 111.35,40 115,40 | v64.9,44.4 64.9,43.71 64.77,43.58
SDA  (via drill 0.35)
  Top 0.406: R5.1 72.09,49.58 v70.61,49.58 68.78,51.41 U1.11 | v70.48,45.72 70.36,45.72 67.44,42.8 GPIO.4 | v21.53,77.52 21.55,77.5 28.69,77.5 J4.8 | v21.14,47.52 21.17,47.49 28.68,47.49 J3.8 | J2.8 111.31,42.5 v116.62,42.5 | v115.95,72.39 111.34,72.39 J1.8 | v103.5,103.5 R9.1
  Bottom 0.406: 67.44,42.77 42.16,42.77 34.39,35 26,35 22.03,38.97 22.03,47.5 | v70.61,49.58 70.61,45.85 v70.48,45.72 | GPIO.4 67.44,42.77 | 67.44,42.77 94.73,42.77 102.5,35 112.5,35 115.72,38.22 115.72,42.5 | 22.03,47.5 22,75.49 22,77.05 v21.53,77.52 | v21.14,47.52 21.16,47.5 22.03,47.5 | 115.72,42.5 115.72,72.25 115.85,72.39 v115.95,72.39 115.25,73.09 115.25,92.65 108.84,99.06 104.46,99.06 103.5,100.01 v103.5,103.5 | v116.62,42.5 115.72,42.5
SWCLK
  Top 0.406: R8.1 73.79,93.65 74.42,93.01 74.42,91.11 73.79,90.47 JTAG.4 71.25,90.47 70.61,89.84 70.61,80.44 PROGRAMMING.3 69.98,78.23 66.47,74.73 66.47,67.74 67.98,66.23 U1.31
SWDIO
  Top 0.406: JTAG.2 71.25,91.74 69.98,90.47 69.98,85.39 67.44,82.85 PROGRAMMING.4 67.44,77.9 65.71,76.17 65.71,67.44 67.18,65.97 U1.32
TS
  Top 0.406: U1.7 arc-90 U1.7 65.79,58 62.37,58 58,53.63 C9.1
  Top 0.813: C9.1 R4.2
USB_D_N  (via drill 0.35)  (2 unrouted)
  Top 0.254: J6.A7 57.76,113.86 58.01,114.11 58.52,114.11 58.76,113.87 J6.B7 | 58.74,112.32 J6.B7 | 58.79,112.31 J6.B7 | J6.B7 58.76,111.04 58.91,110.89 CR2.4 | J5.D- 83.12,110.02 82.02,111.12 82.02,112.93 81.28,113.67 80.01,113.67 79.38,113.03 79.38,109.45 81.25,107.57 81.25,106.85 CR1.6
  Top 0.406: U1.23 75.9,61.99 80.33,66.42 80.33,93.54 74.74,99.13 65.28,99.13 | 65.28,99.13 61.49,99.13 58.94,101.68 58.94,105.29 CR2.3 | CR1.1 81.33,103.38 80.19,102.23 65.94,102.23 v65.31,102.87 | v65.28,100.04 65.28,99.13
  Bottom 0.406: v65.31,102.87 65.28,102.84 v65.28,100.04
USB_D_P  (via drill 0.35)  (2 unrouted)
  Top 0.254: J6.A6 58.24,112.32 58.24,111.58 58.23,111.57 58.23,111.04 57.26,111.04 | 57.26,111.04 57.26,111.01 57.01,110.76 CR2.6 | 57.26,111.04 J6.B6 | J5.D+ 84.52,112 84.82,111.7 84.82,109.12 83.23,107.53 CR1.4
  Top 0.406: U1.24 75.84,62.79 79.69,66.64 79.69,93.32 74.49,98.52 64.67,98.52 | 64.67,98.52 61.23,98.52 56.91,102.83 56.91,104.3 57.01,104.4 CR2.1 | CR1.3 83.23,102.11 82.75,101.63 64.6,101.63 64.03,102.2 v64,102.2 | v63.99,97.59 63.99,97.83 64.67,98.52
  Bottom 0.406: v63.99,97.59 64,97.6 v64,102.2
VBUSC  (via drill 0.35)
  Top 0.508: FB1.1 66.5,110.34 66.04,109.88 C11.1 63.18,108.9 60.96,106.68 58.42,106.68 57.96,107.14 CR2.5 v57.96,109.65
  Top 0.61: J6.A9 55.6,110.14 v55.88,109.86 | J6.A4 60.4,109.93 v60.33,109.86
  Bottom 0.61: v55.88,109.86 56.08,109.65 v57.96,109.65 60.12,109.65 v60.33,109.86
VBUSD
  Top 0.508: C13.1 73.66,109.83 73.2,110.29 FB2.1
  Top 0.61: J5.VBUS 80.75,109.11 82.28,107.58 CR1.5 82.28,106.24 81.45,105.41 79.38,105.41 75.89,108.9 C13.1
VBUSFC
  Top 0.508: C12.1 68.58,109.8 68.12,110.27 FB1.2 68.12,112.22 67.46,112.88 J7.1
VBUSFD
  Top 0.508: C14.1 71.12,109.86 71.58,110.31 FB2.2 71.58,112.22 72.54,113.18 J7.3
VBUSOUT
  Top 0.813: D1.A 85.9,79.84 85.9,107.95 86.36,108.41 86.36,112.39 81.28,117.47 71.12,117.47 70,116.36 J7.2
XTAL1
  Top 0.406: U1.1 64.66,62.79 arc45 64.64,62.79 arc-45 64.21,62.97 63.12,64.06 arc45 62.25,64.42 X1.P$1 | 57.54,64.42 arc-45 C6.2
  Top 0.61: X1.P$1 57.54,64.42
XTAL2
  Top 0.406: U1.2 60.86,61.99 arc-90 X1.P$2 | 57.73,62.02 arc45 C7.2
  Top 0.61: X1.P$2 57.73,62.02

### Text on the board
tNames: VCC | SWDIO | GND | SWCLK | GND | SWO | KEY | NC | DTCT | RESET | 3V3 | SWDIO | SWCLK | RESET | GND | U1 | SCL | SDA | GND | 3V3 | 5V | Static Platform Main / v1.1 2315